# EAGLE design Bluetooth RC car (EAGLE 7.5.0)
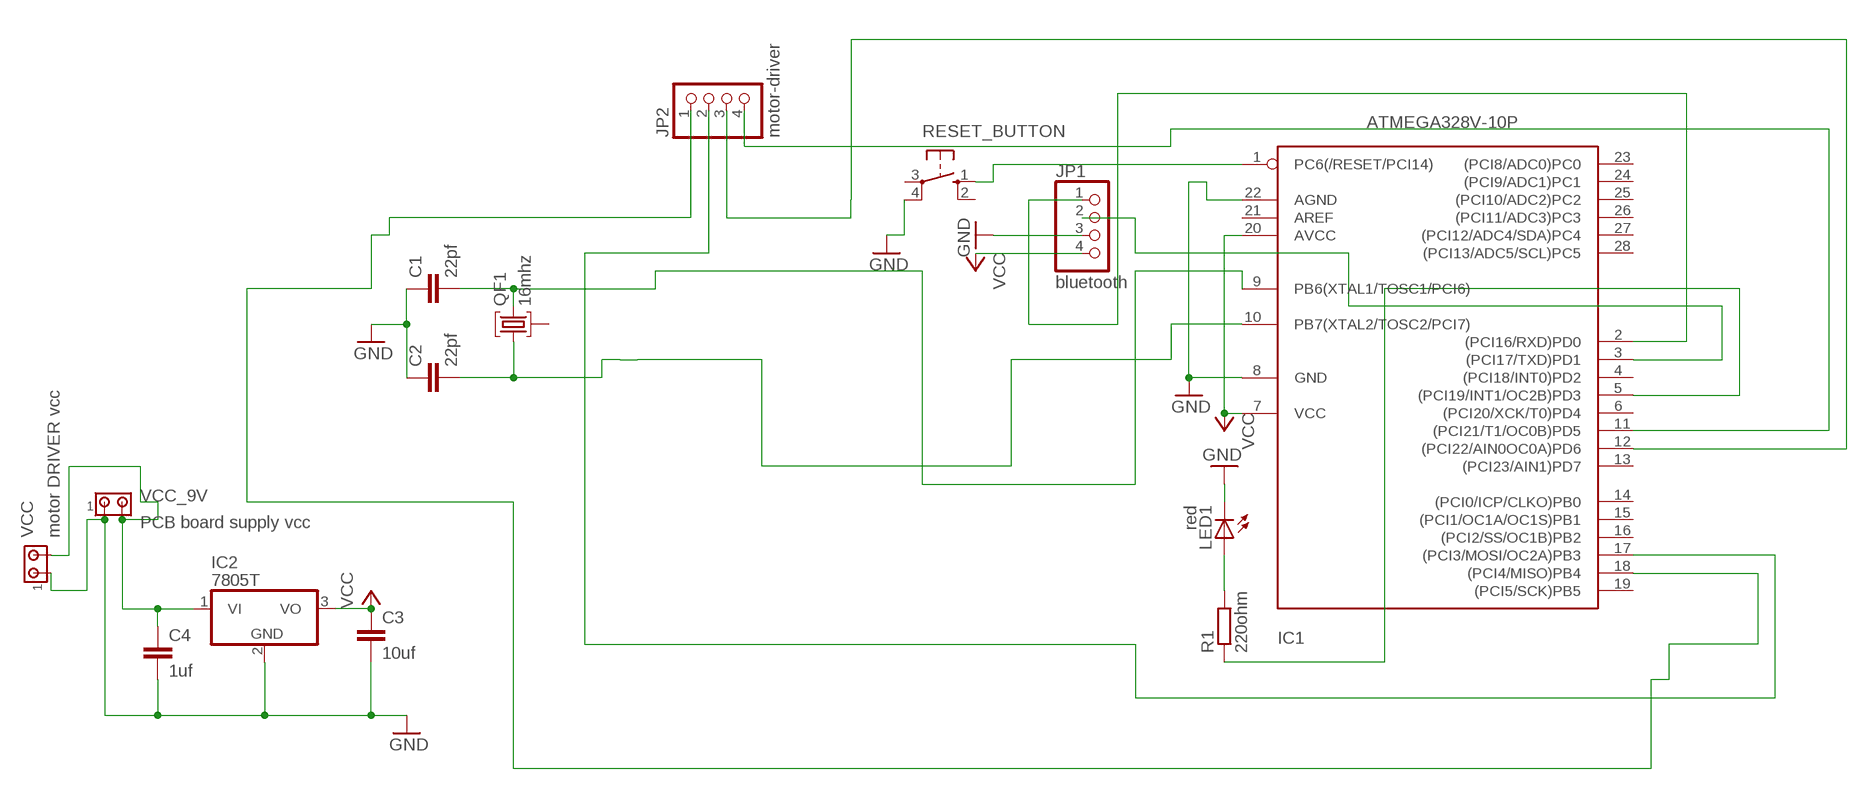
[diagram p0: schematic, sheet 1]

## Parts
C1  22pf  C5/2.5  [C5B2.5]
C2  22pf  C5/2.5  [C5B2.5]
C3  10uf  C5/3  [C5B3]
C4  1uf  C5/3  [C5B3]
IC1  ATMEGA328V-10P  [DIL28-3]
IC2  7805T  [TO220H]
JP1  bluetooth  PINHD-1X4  [1X04]
JP2  motor-driver  PINHD-1X4  [1X04]
LED1  red  LED5MM  [LED5MM]
QF1  16mhz  17M15AUM1  [UM1]
R1  220ohm  R-EU_0207/7  [0207/7]
RESET_BUTTON  40-XX  [B3F-40XX]
VCC  motor DRIVER vcc  MTA02-100  [10X02MTA]
VCC_9V  PCB board supply vcc  MTA02-100  [10X02MTA]

## Nets
GND: C1.1 C2.1 C3.2 C4.2 IC1.8(GND) IC1.22(AGND) IC2.2(GND) JP1.3 LED1.K(C) RESET_BUTTON.4(P1) VCC.1 VCC_9V.1
N$1: IC1.1(PC6(/RESET/PCI14)) RESET_BUTTON.1(S)
N$2: C4.1 IC2.1(VI) VCC.2 VCC_9V.2
N$3: IC1.5((PCI19/INT1/OC2B)PD3) R1.1
N$4: LED1.A R1.2
N$5: IC1.2((PCI16/RXD)PD0) JP1.1
N$6: IC1.11((PCI21/T1/OC0B)PD5) JP2.4
N$8: IC1.18((PCI4/MISO)PB4) JP2.1
N$9: IC1.3((PCI17/TXD)PD1) JP1.2
N$10: IC1.17((PCI3/MOSI/OC2A)PB3) JP2.2
N$11: IC1.12((PCI22/AIN0OC0A)PD6) JP2.3
N$12: C1.2 IC1.9(PB6(XTAL1/TOSC1/PCI6)) QF1.3
N$14: C2.2 IC1.10(PB7(XTAL2/TOSC2/PCI7)) QF1.1
VCC: C3.1 IC1.7(VCC) IC1.20(AVCC) IC2.3(VO) JP1.4
Unconnected: IC1.4((PCI18/INT0)PD2) IC1.6((PCI20/XCK/T0)PD4) IC1.13((PCI23/AIN1)PD7) IC1.14((PCI0/ICP/CLKO)PB0) IC1.15((PCI1/OC1A/OC1S)PB1) IC1.16((PCI2/SS/OC1B)PB2) IC1.19((PCI5/SCK)PB5) IC1.21(AREF) IC1.23((PCI8/ADC0)PC0) IC1.24((PCI9/ADC1)PC1) IC1.25((PCI10/ADC2)PC2) IC1.26((PCI11/ADC3)PC3) IC1.27((PCI12/ADC4/SDA)PC4) IC1.28((PCI13/ADC5/SCL)PC5) QF1.2 RESET_BUTTON.2(S1) RESET_BUTTON.3(P)

## Library data of the parts
C1-C4 = capacitor-wima:C: CAPACITOR naming: grid - package width
IC1 = atmega328:ATMEGA328*P: MICROCONTROLLER 32 kBytes FLASH 2 kBytes SRAM 1 kBytes EEPROM USART 8-channel 10 bit ADC
IC2 = adafruit:78*: Positive VOLTAGE REGULATOR Added bigger pads to the TO-92 package
JP1 JP2 = pinhead:PINHD-1X4: PIN HEADER
LED1 = adafruit:LED: LED OSRAM: - CHIPLED LG R971, LG N971, LY N971, LG Q971, LY Q971, LO R971, LY R971 LH N974, LH R974 LS Q976, LO Q976, LY Q976 LO Q996 - Hyper CHIPLED LW Q18S LB Q993, LB Q99A, LB R99A - SideLED LS A670, LO A670, LY A670, LG A670, LP A670 LB A673, LV A673, LT A673, LW A673 LH A674 LY A675 LS A676, LA A676, LO A676, LY A676, LW A676 LS A679, LY A679, LG A679 - Hyper Micro SIDELED® LS Y876, LA Y876, LO Y876, LY Y876 LT Y87S - SmartLED LW L88C, LW L88S LB L89C, LB L89S, LG L890 LS L89K, LO L89K, LY L89K LS L896, LA L896, LO L896, LY L896 - TOPLED LS T670, LO T670, LY T670, LG T670, LP T670 LSG T670, LSP T670, LSY T670, LOP T670, LYG T670 LG T671, LOG T671, LSG T671 LB T673, LV T673, LT T673, LW T673 LH T674 LS T676, LA T676, LO T676, LY T676, LB T676, LH T676, LSB T676, LW T676 LB T67C, LV T67C, LT T67C, LS T67K, LO T67K, LY T67K, LW E67C LS E67B, LA E67B, LO E67B, LY E67B, LB E67C, LV E67C, LT E67C LW T67C LS T679, LY T679, LG T679 LS T770, LO T770, LY T770, LG T770, LP T770 LB T773, LV T773, LT T773, LW T773 LH T774 LS E675, LA E675, LY E675, LS T675 LS T776, LA T776, LO T776, LY T776, LB T776 LHGB T686 LT T68C, LB T68C - Hyper Mini TOPLED® LB M676 - Mini TOPLED Santana® LG M470 LS M47K, LO M47K, LY M47K Source: http://www.osram.convergy.de/
QF1 = crystal:17M15AUM1: Monolithic Crystal Filters Source: www.vanlong.com; OC_FARNELL: unknown; OC_NEWARK: unknown
R1 = resistor:R-EU_: RESISTOR, European symbol
RESET_BUTTON = switch-omron:40-XX: OMRON SWITCH; MF: OMRON COMPONENTS USA; MPN: B3F-4000; OC_FARNELL: 176434; OC_NEWARK: 36K3105
VCC VCC_9V = con-amp:MTA02-100: AMP connector

## Board
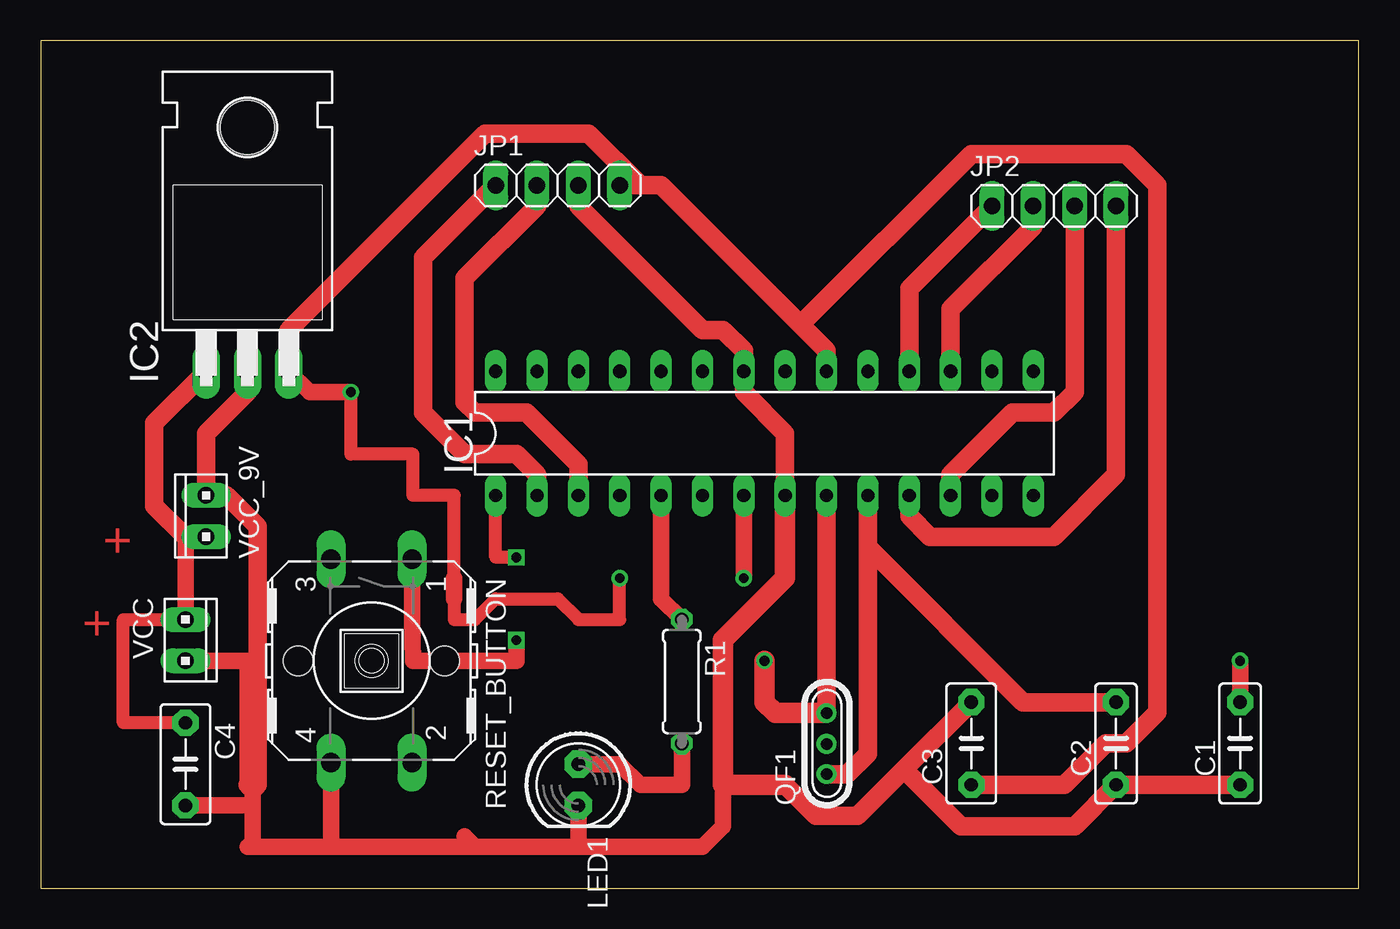
[diagram p1: board, top side]
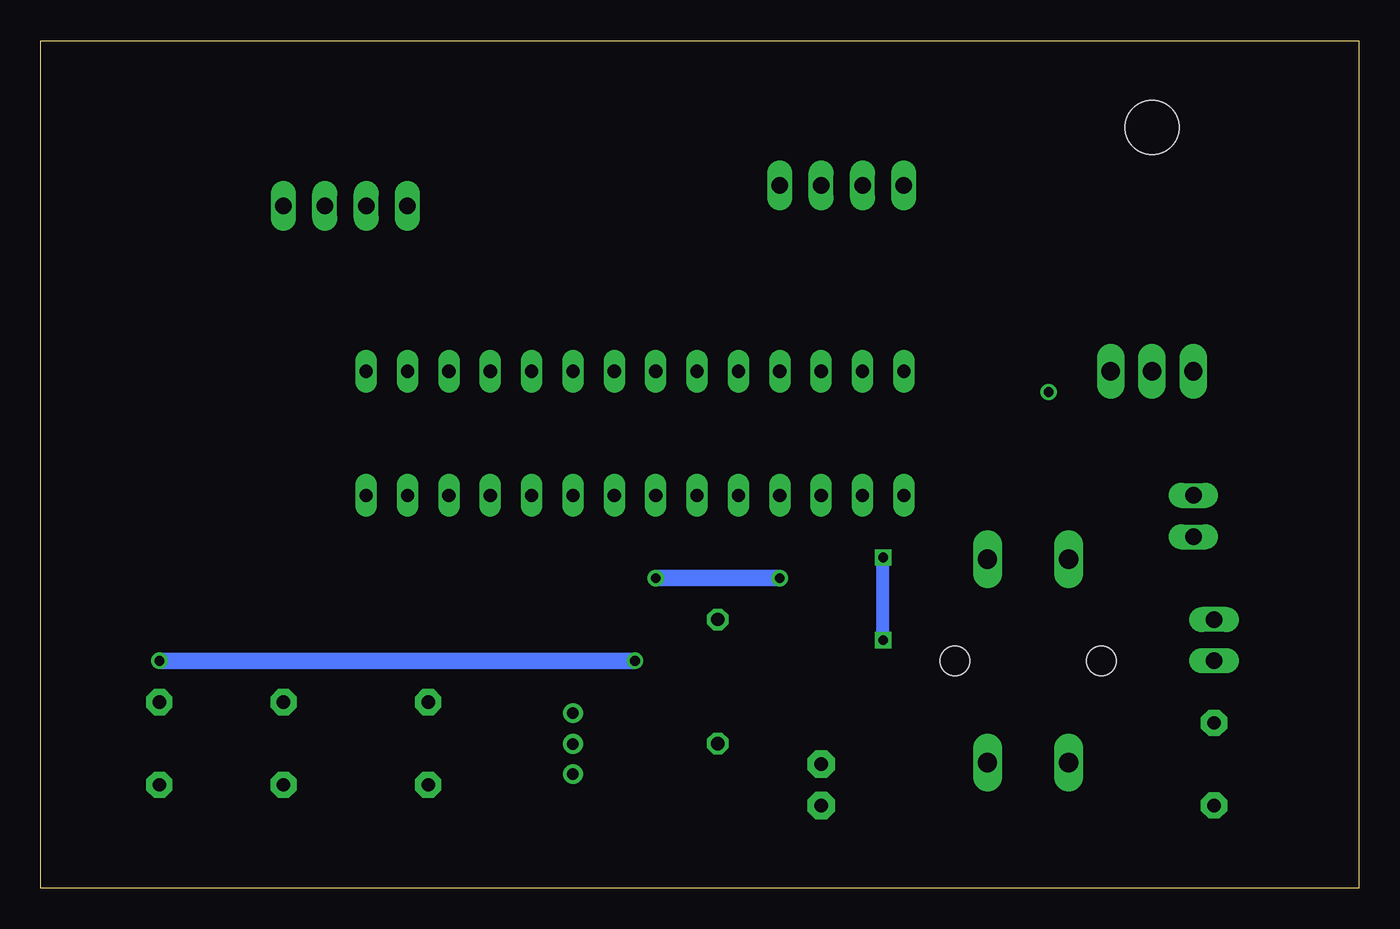
[diagram p2: board, bottom side, seen from below]

Size 80.95 x 52.06 mm. Coordinates in mm from the lower left corner, seen from the top.
Outline: 0,0 80.95,0 80.95,52.06 0,52.06 0,0
Copper layers (1*16): Top 0.035mm / dielectric 1.5mm / Bottom 0.035mm
Design rules "default *": minimum track width 45mil, minimum drill 29mil, track to track 35mil, track to pad 25mil, pad to pad 20mil, via to via 15mil, smd to smd 8mil, copper to edge 60mil, drill to drill 20mil, minimum pad ring 10mil, minimum via ring 8mil, stop-mask expansion 8mil, vias tented up to drill 0mil, thermal gap 10mil

### Footprints (pad centres in the part's own frame; a part is rotated, then mirrored left to right if it is on the bottom)
C5B2.5 = drill 0.813 pad 1.6 octagon: 1 -2.54,0; 2 2.54,0
C5B3 = drill 0.813 pad 1.6 octagon: 1 -2.54,0; 2 2.54,0
DIL28-3 = drill 0.813 long: 1 -16.51,-3.81; 2 -13.97,-3.81; 3 -11.43,-3.81; 4 -8.89,-3.81; 5 -6.35,-3.81; 6 -3.81,-3.81; 7 -1.27,-3.81; 8 1.27,-3.81; 9 3.81,-3.81; 10 6.35,-3.81; 11 8.89,-3.81; 12 11.43,-3.81; 13 13.97,-3.81; 14 16.51,-3.81; 15 16.51,3.81; 16 13.97,3.81; 17 11.43,3.81; 18 8.89,3.81; 19 6.35,3.81; 20 3.81,3.81; 21 1.27,3.81; 22 -1.27,3.81; 23 -3.81,3.81; 24 -6.35,3.81; 25 -8.89,3.81; 26 -11.43,3.81; 27 -13.97,3.81; 28 -16.51,3.81
TO220H = drill 1.118 long: 1 -2.54,-10.16; 2 0,-10.16; 3 2.54,-10.16 | hole 3.302: 0,4.826
1X04 = drill 1.016 long: 1 -3.81,0; 2 -1.27,0; 3 1.27,0; 4 3.81,0
LED5MM = drill 0.813 pad 1.676 octagon: A -1.27,0; K 1.27,0
UM1 = drill 0.7 pad 1.2: 1 -1.875,0; 2 -0.027,0; 3 1.875,0
0207/7 = drill 0.813 octagon: 1 -3.81,0; 2 3.81,0
B3F-40XX = drill 1.194 long: 1 -6.248,2.489; 2 6.248,2.489; 3 -6.248,-2.489; 4 6.248,-2.489 | hole 1.803: 0,-4.496; 0,4.496
10X02MTA = drill 1.016 long: 1 1.27,0; 2 -1.27,0

### Placement (x,y rotation side)
C1  73.66,8.89 90 top
C2  66.04,8.89 90 top
C3  57.15,8.89 90 top
C4  8.89,7.62 270 top
IC1  44.45,27.94 0 top
IC2  12.7,41.91 0 top
JP1  31.75,43.18 0 top
JP2  62.23,41.91 0 top
LED1  33.02,6.35 270 top
QF1  48.26,8.89 90 top
R1  39.37,12.7 270 top
RESET_BUTTON  20.32,13.97 270 top
VCC  8.89,15.24 270 top
VCC_9V  10.16,22.86 90 top

### Tracks (layer width: path | path; a pad name or v marks a point on that pad's centre or on a via)
GND
  Top 1.016: VCC.1 12.7,13.97 12.7,6.35 | 26.04,3.17 26.67,2.54 | 26.67,2.54 33.02,2.54 | 33.02,2.54 40.64,2.54 41.91,3.81 41.91,6.35 | LED1.K 33.02,2.54 | 13.02,6.03 13.02,5.08 | 13.02,5.08 13.02,2.86 12.7,2.54 17.78,2.54 | 17.78,2.54 26.67,2.54 | RESET_BUTTON.4 17.83,2.59 17.78,2.54 | C4.2 13.02,5.08
  Top 1.143: IC2.2 12.7,30.48 10.16,27.94 VCC_9V.1 11.43,24.13 13.34,22.22 13.34,6.35 13.02,6.03 12.7,6.35 | C1.1 C2.1 63.5,3.81 56.52,3.81 53.02,7.3 | IC1.8 45.72,27.94 43.18,30.48 IC1.22 43.18,33.02 41.91,34.29 40.64,34.29 33.02,41.91 JP1.3 | 53.02,7.3 50.16,4.45 47.62,4.45 45.72,6.35 | 53.02,7.3 C3.2
  Top 1.27: 45.72,6.35 41.91,6.35 41.91,15.24 45.72,19.05 IC1.8
N$1  (via drill 0.6)
  Top 0.813: v29.21,20.32 27.94,20.32 IC1.1
  Top 1.016: RESET_BUTTON.1 22.81,16.56 22.86,13.97 29.21,13.97 v29.21,15.24
  Bottom 0.813: v29.21,15.24 v29.21,20.32
N$2
  Top 0.813: C4.1 5.08,10.16 5.08,16.51 VCC.2
  Top 1.016: 8.89,21.59 VCC.2
  Top 1.143: VCC_9V.2 8.89,21.59 6.99,23.49 6.99,28.57 IC2.1
N$3
  Top 1.016: IC1.5 38.1,17.78 R1.1
N$4
  Top 1.016: LED1.A 35.56,7.62 36.83,6.35 39.37,6.35 R1.2
N$5
  Top 1.143: IC1.2 30.48,25.4 29.21,26.67 26.04,26.67 23.5,29.21 23.5,38.73 JP1.1
N$6
  Top 1.143: IC1.11 53.34,22.86 54.61,21.59 62.23,21.59 66.04,25.4 JP2.4
N$8
  Top 1.143: IC1.18 53.34,36.83 JP2.1
N$9
  Top 1.143: IC1.3 33.02,26.04 29.85,29.21 26.67,29.21 26.04,29.84 26.04,37.47 30.48,41.91 JP1.2
N$10
  Top 1.143: IC1.17 55.88,35.56 60.96,40.64 JP2.2
N$11
  Top 1.143: IC1.12 55.88,25.4 59.69,29.21 62.23,29.21 63.5,30.48 JP2.3
N$12  (via drill 0.6)
  Top 1.016: v73.66,13.97 C1.2
  Top 1.143: IC1.9 QF1.3
  Top 1.27: QF1.3 45.11,10.77 44.45,11.43 v44.45,13.97
  Bottom 1.016: v44.45,13.97 v73.66,13.97
N$14
  Top 1.143: IC1.10 50.8,20.95 | 50.8,20.95 50.8,8.26 49.53,6.98 48.26,6.98 QF1.1 | C2.2 60.32,11.43 50.8,20.95
VCC  (via drill 0.6)
  Top 0.813: 25.4,19.05 25.4,24.13 22.86,24.13 22.86,26.67 19.05,26.67 v19.05,30.48 | 25.4,17.78 25.4,16.51 26.67,16.51 27.94,17.78 31.75,17.78 33.02,16.51 35.56,16.51 v35.56,19.05
  Top 1.016: IC1.7 v43.18,19.05 | v19.05,30.48 16.51,30.48 IC2.3 | 25.4,19.05 25.4,17.78
  Top 1.143: IC1.20 48.26,33.02 46.67,34.61 | 46.67,34.61 38.1,43.18 36.83,43.18 | JP1.4 36.83,43.18 | C3.1 62.86,6.35 65.41,8.89 66.67,8.89 68.58,10.79 68.58,43.18 66.67,45.09 57.15,45.09 46.67,34.61 | IC2.3 15.24,34.29 27.3,46.36 33.66,46.36 36.83,43.18
  Bottom 1.016: v43.18,19.05 v35.56,19.05

### Text on the board
Top: + | +
Pads: bluetooth RC car | www.facebook.com/etech99
Vias: - ve | - ve